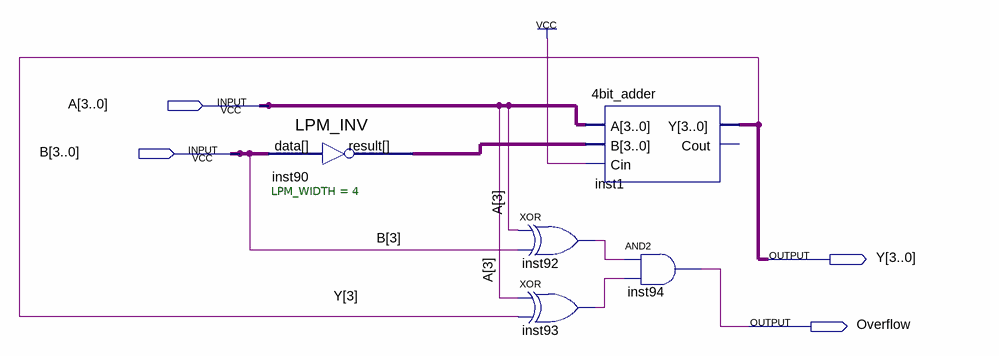
[diagram p0: schematic sheet]
// Quartus schematic substract_4bits.bdf as structural Verilog: 5 symbols, 4 pins
module substract_4bits (
  input  [3:0] A,
  input  [3:0] B,
  output [3:0] Y,
  output Overflow
);

  wire inst92_out, inst93_out;
  wire [3:0] inst90_result;

  LPM_INV #(.LPM_WIDTH(4)) inst90 (.data(B), .result(inst90_result));
  xor inst92 (inst92_out, A[3], B[3]);
  xor inst93 (inst93_out, A[3], Y[3]);
  \4bit_adder  inst1 (.A(A), .B(inst90_result), .Cin(1'b1), .Y(Y));  // open: Cout
  and inst94 (Overflow, inst92_out, inst93_out);
endmodule
